# Altium schematic sheet VOLTAGE_MEASURE.SchDoc
size A4
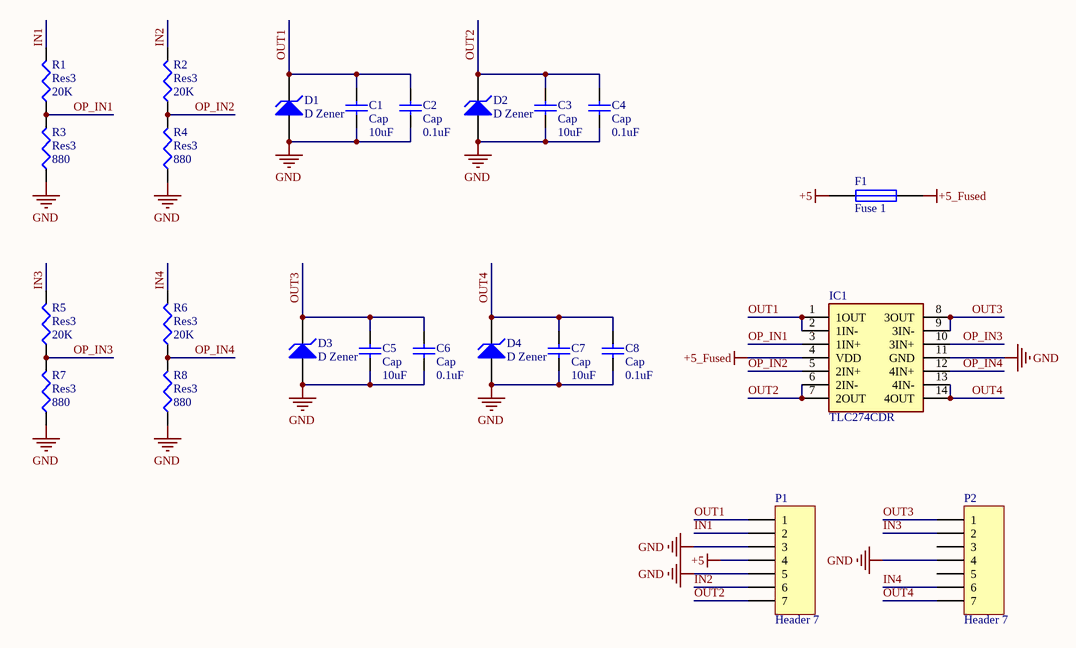
[diagram p0: VOLTAGE_MEASURE.SchDoc]

## Parts
C1  Cap  value 10uF  [C1206]
C2  Cap  value 0.1uF  [1608[0603]]
C3  Cap  value 10uF  [C1206]
C4  Cap  value 0.1uF  [1608[0603]]
C5  Cap  value 10uF  [C1206]
C6  Cap  value 0.1uF  [1608[0603]]
C7  Cap  value 10uF  [C1206]
C8  Cap  value 0.1uF  [1608[0603]]
D1  D Zener  [C1206]
D2  D Zener  [C1206]
D3  D Zener  [C1206]
D4  D Zener  [C1206]
F1  Fuse 1  [C1206]
IC1  TLC274CDR  [SOIC127P600X175-14N]
P1  Header 7  [HDR1X7]
P2  Header 7  [HDR1X7]
R1  Res3  value 20K  [J1-0603]
R2  Res3  value 20K  [J1-0603]
R3  Res3  value 880  [J1-0603]
R4  Res3  value 880  [J1-0603]
R5  Res3  value 20K  [J1-0603]
R6  Res3  value 20K  [J1-0603]
R7  Res3  value 880  [J1-0603]
R8  Res3  value 880  [J1-0603]

## Nets
+5: F1.2 P1.4
+5_Fused: F1.1 IC1.4(VDD)
GND: C1.1 C2.1 C3.1 C4.1 C5.1 C6.1 C7.1 C8.1 D1.1(A) D2.1(A) D3.1(A) D4.1(A) IC1.11(GND) P1.3 P1.5 P2.4 R3.1 R4.1 R7.1 R8.1
IN1: P1.2 R1.2
IN2: P1.6 R2.2
IN3: P2.2 R5.2
IN4: P2.6 R6.2
OP_IN1: IC1.3(1IN+) R1.1 R3.2
OP_IN2: IC1.5(2IN+) R2.1 R4.2
OP_IN3: IC1.10(3IN+) R5.1 R7.2
OP_IN4: IC1.12(4IN+) R6.1 R8.2
OUT1: C1.2 C2.2 D1.2(K) IC1.1(1OUT) IC1.2(1IN-) P1.1
OUT2: C3.2 C4.2 D2.2(K) IC1.6(2IN-) IC1.7(2OUT) P1.7
OUT3: C5.2 C6.2 D3.2(K) IC1.8(3OUT) IC1.9(3IN-) P2.1
OUT4: C7.2 C8.2 D4.2(K) IC1.13(4IN-) IC1.14(4OUT) P2.7

Not connected (* = marked no-connect by the designer): P2 3 5

## Library data of the parts
C1-C8 = Cap: Capacitor; Published: 8-Jun-2000; LatestRevisionDate: 17-Jul-2002; LatestRevisionNote: Re-released for DXP Platform.; PackageReference: RAD-0.3; Publisher: Altium Limited; PackageDescription: Radial Cap, Thru-Hole; 2 Leads; 0.3 in Pin Spacing
D1-D4 = D Zener: Zener Diode; Published: 8-Jun-2000; LatestRevisionDate: 17-Jul-2002; LatestRevisionNote: Re-released for DXP Platform.; PackageReference: DIODE-0.7; Publisher: Altium Limited; PackageDescription: Diode, Thru-Hole; 2 Leads; 0.7 in Pin Spacing
F1 = Fuse 1: Fuse; Published: 8-Jun-2000; LatestRevisionDate: 17-Jul-2002; LatestRevisionNote: Re-released for DXP Platform.; PackageReference: PIN-W2/E2.8; Publisher: Altium Limited; PackageDescription: Thru-Hole; 2 Leads
IC1 = TLC274CDR: Integrated Circuit; Manufacturer_Name: Texas Instruments; Datasheet Link: http://www.ti.com/lit/gpn/tlc274; Manufacturer_Part_Number: TLC274CDR; Mouser Part Number: 595-TLC274CDR; Mouser Price/Stock: https://www.mouser.com/Search/Refine.aspx?Keyword=595-TLC274CDR; RS Part Number: 0527237; RS Price/Stock: http://uk.rs-online.com/web/p/products/0527237
P1 P2 = Header 7: Header, 7-Pin; LatestRevisionDate: 17-Jul-2002; LatestRevisionNote: Re-released for DXP Platform.; Publisher: Altium Limited
R1-R8 = Res3: Resistor; Published: 8-Jun-2000; LatestRevisionDate: 29-May-2009; LatestRevisionNote: IPC-7351 Footprint Added.; PackageReference: J1-0603; Publisher: Altium Limited; PackageDescription: Chip Resistor